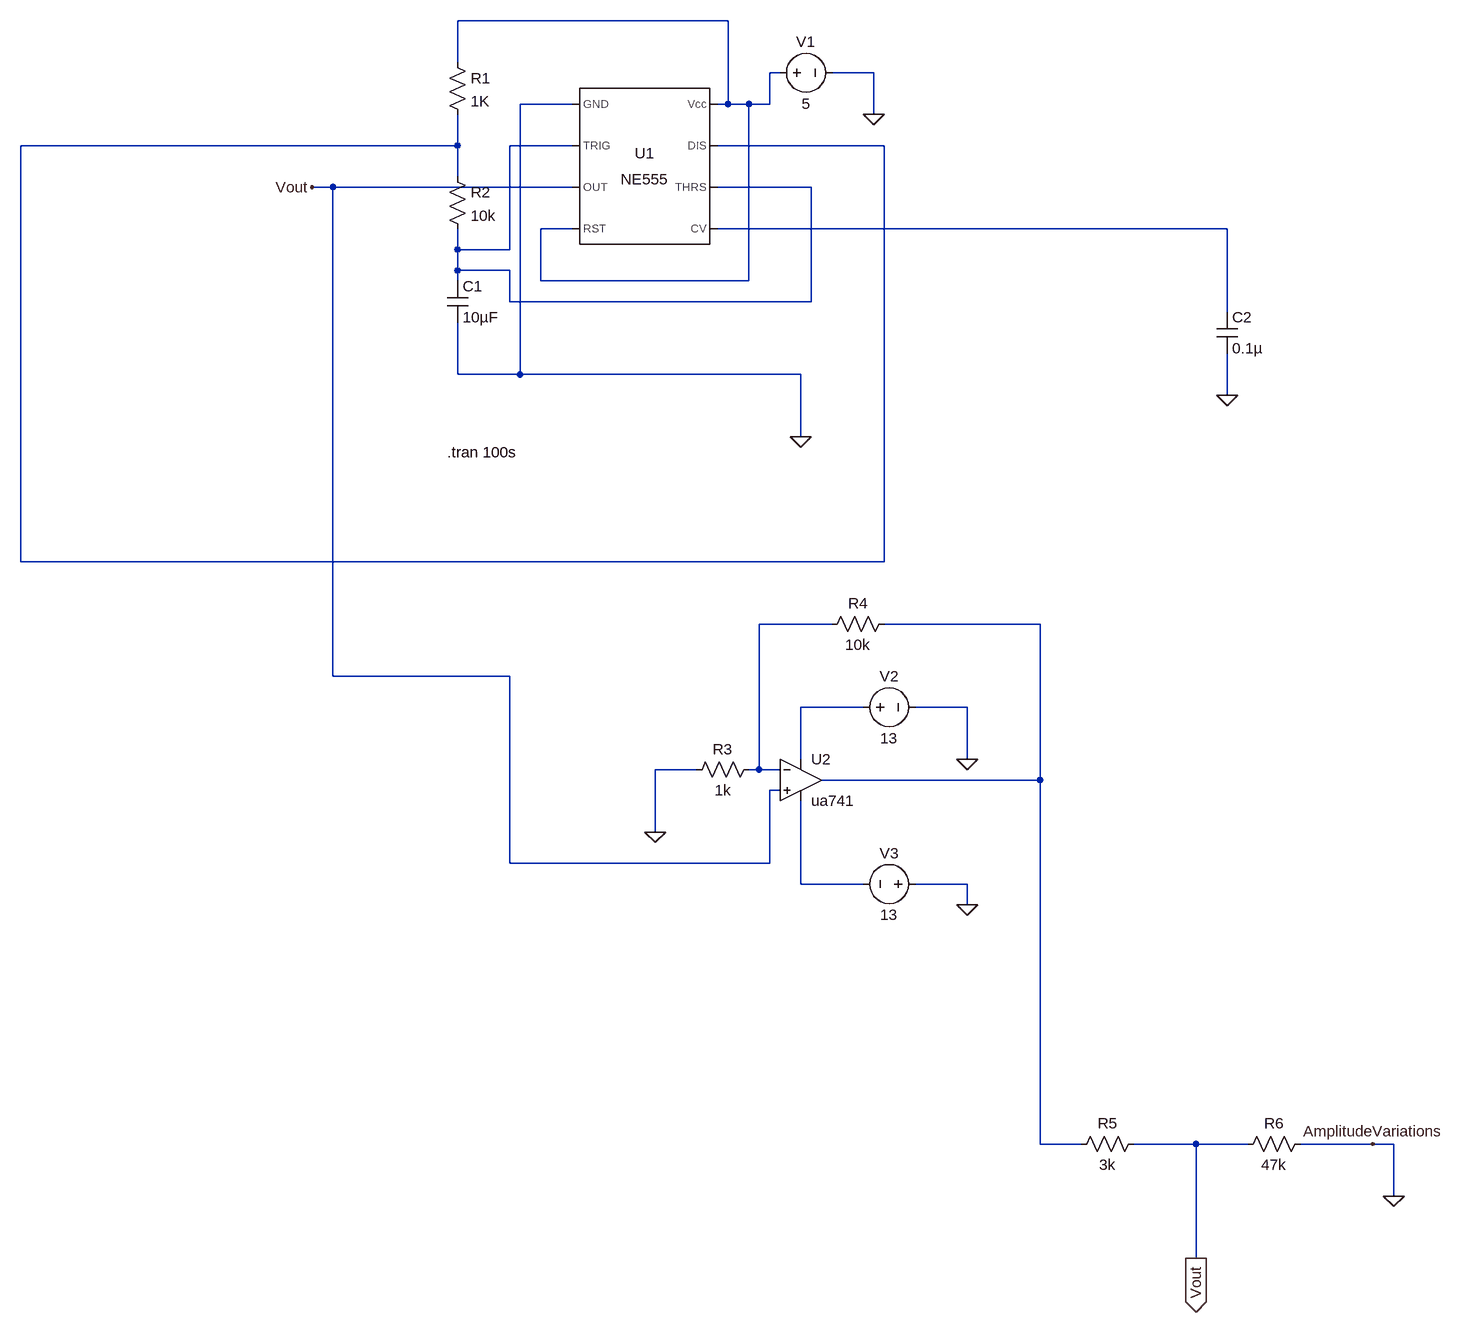
[diagram p0: schematic pulse or rectangular generator[1].asc]
pulse or rectangular generator[1].asc, the LTspice schematic file:
Version 4
SHEET 1 1544 1968
WIRE 416 -48 0 -48
WIRE 0 16 0 -48
WIRE 496 32 480 32
WIRE 640 32 576 32
WIRE 176 80 96 80
WIRE 416 80 416 -48
WIRE 416 80 400 80
WIRE 448 80 416 80
WIRE 480 80 480 32
WIRE 480 80 448 80
WIRE 640 96 640 32
WIRE 0 144 0 96
WIRE 0 144 -672 144
WIRE 176 144 80 144
WIRE 656 144 400 144
WIRE 0 192 0 144
WIRE -192 208 -224 208
WIRE 176 208 -192 208
WIRE 544 208 400 208
WIRE 176 272 128 272
WIRE 1184 272 400 272
WIRE 0 304 0 272
WIRE 80 304 80 144
WIRE 80 304 0 304
WIRE 0 336 0 304
WIRE 80 336 0 336
WIRE 0 352 0 336
WIRE 128 352 128 272
WIRE 448 352 448 80
WIRE 448 352 128 352
WIRE 80 384 80 336
WIRE 544 384 544 208
WIRE 544 384 80 384
WIRE 1184 400 1184 272
WIRE 0 496 0 416
WIRE 96 496 96 80
WIRE 96 496 0 496
WIRE 528 496 96 496
WIRE 1184 528 1184 464
WIRE 528 592 528 496
WIRE -672 784 -672 144
WIRE 656 784 656 144
WIRE 656 784 -672 784
WIRE 576 880 464 880
WIRE 896 880 656 880
WIRE -192 960 -192 208
WIRE 80 960 -192 960
WIRE 624 1008 528 1008
WIRE 784 1008 704 1008
WIRE 528 1088 528 1008
WIRE 784 1088 784 1008
WIRE 368 1104 304 1104
WIRE 464 1104 464 880
WIRE 464 1104 448 1104
WIRE 496 1104 464 1104
WIRE 896 1120 896 880
WIRE 896 1120 560 1120
WIRE 496 1136 480 1136
WIRE 304 1200 304 1104
WIRE 80 1248 80 960
WIRE 480 1248 480 1136
WIRE 480 1248 80 1248
WIRE 528 1280 528 1152
WIRE 624 1280 528 1280
WIRE 784 1280 704 1280
WIRE 784 1312 784 1280
WIRE 896 1680 896 1120
WIRE 960 1680 896 1680
WIRE 1136 1680 1040 1680
WIRE 1216 1680 1136 1680
WIRE 1408 1680 1296 1680
WIRE 1440 1680 1408 1680
WIRE 1440 1760 1440 1680
WIRE 1136 1856 1136 1680
FLAG 640 96 0
FLAG 528 592 0
FLAG -224 208 Vout
FLAG 304 1200 0
FLAG 784 1088 0
FLAG 784 1312 0
FLAG 1184 528 0
FLAG 1440 1760 0
FLAG 1136 1856 Vout
IOPIN 1136 1856 Out
FLAG 1408 1680 AmplitudeVariations
SYMBOL Misc\\NE555 288 176 R0
SYMATTR InstName U1
SYMBOL voltage 480 32 R270
WINDOW 0 32 56 VTop 2
WINDOW 3 -32 56 VBottom 2
WINDOW 123 0 0 Left 0
WINDOW 39 0 0 Left 0
SYMATTR InstName V1
SYMATTR Value 5
SYMBOL res -16 0 R0
SYMATTR InstName R1
SYMATTR Value 1K
SYMBOL res -16 176 R0
SYMATTR InstName R2
SYMATTR Value 10k
SYMBOL cap -16 352 R0
SYMATTR InstName C1
SYMATTR Value 10µF
SYMBOL OpAmps\\ua741 528 1056 R0
SYMATTR InstName U2
SYMBOL res 464 1088 R90
WINDOW 0 0 56 VBottom 2
WINDOW 3 32 56 VTop 2
SYMATTR InstName R3
SYMATTR Value 1k
SYMBOL voltage 608 1008 R270
WINDOW 0 32 56 VTop 2
WINDOW 3 -32 56 VBottom 2
SYMATTR InstName V2
SYMATTR Value 13
SYMBOL voltage 720 1280 R90
WINDOW 0 -32 56 VBottom 2
WINDOW 3 32 56 VTop 2
SYMATTR InstName V3
SYMATTR Value 13
SYMBOL res 672 864 R90
WINDOW 0 0 56 VBottom 2
WINDOW 3 32 56 VTop 2
SYMATTR InstName R4
SYMATTR Value 10k
SYMBOL cap 1168 400 R0
SYMATTR InstName C2
SYMATTR Value 0.1µ
SYMBOL res 1056 1664 R90
WINDOW 0 0 56 VBottom 2
WINDOW 3 32 56 VTop 2
SYMATTR InstName R5
SYMATTR Value 3k
SYMBOL res 1312 1664 R90
WINDOW 0 0 56 VBottom 2
WINDOW 3 32 56 VTop 2
SYMATTR InstName R6
SYMATTR Value 47k
TEXT -16 616 Left 2 !.tran 100s

The netlist it stands for:
* pulse or rectangular generator[1].asc
XU1 0 N003 Vout N001 N004 N003 N002 N001 NE555  ; pins GND TRIG OUT RST CV THRS DIS Vcc
V1 N001 0 5
R1 N001 N002 1K
R2 N002 N003 10k
C1 N003 0 10µF
XU2 Vout N005 N007 N008 N006 ua741  ; pins In+ In- V+ V- OUT
R3 N005 0 1k
V2 N007 0 13
V3 0 N008 13
R4 N006 N005 10k
C2 N004 0 0.1µ
R5 Vout N006 3k
R6 0 Vout 47k
.tran 100s
.lib NE555.sub
.backanno
.end